# EAGLE design ciabatta (EAGLE 4.16)
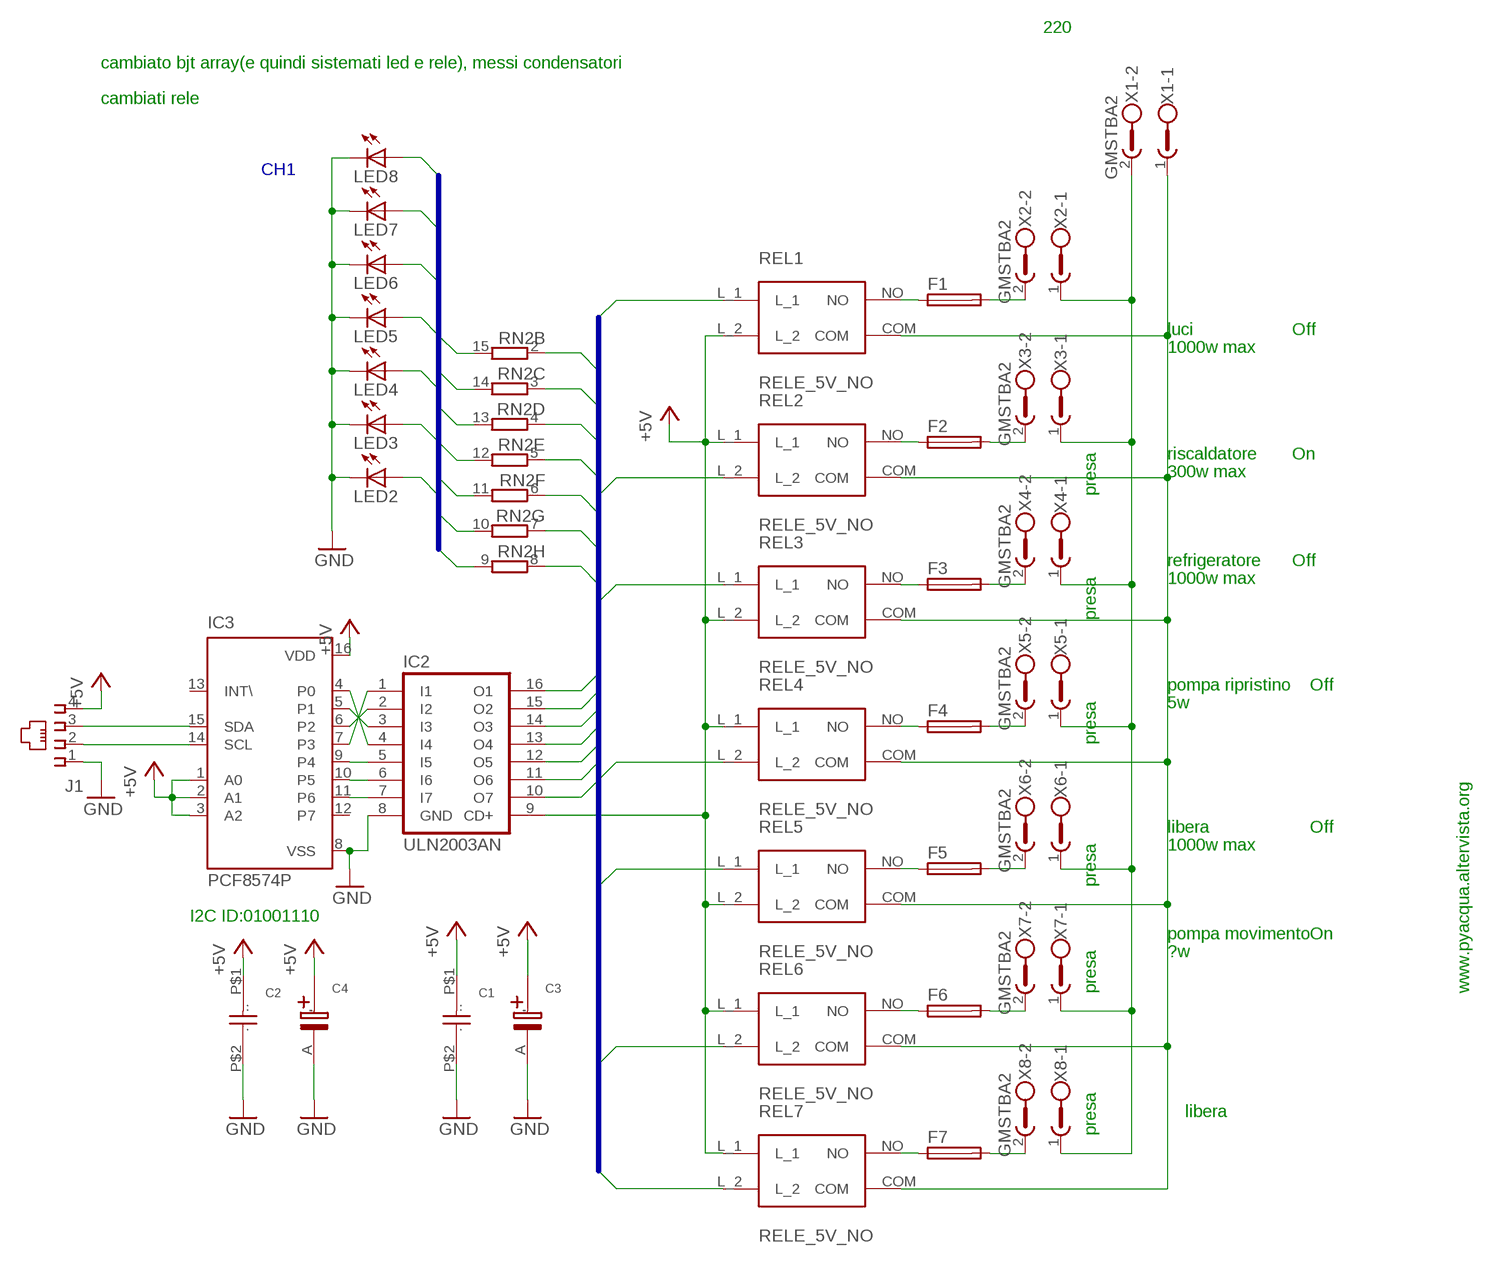
[diagram p0: schematic, sheet 1]

## Parts
C1  CAP_POLI  [CAP_POLI]
C2  CAP_POLI  [CAP_POLI]
C3  CAP_ELET  [CAP_ELET]
C4  CAP_ELET  [CAP_ELET]
F1  SH22,5A  [SH22,5A]
F2  SH22,5A  [SH22,5A]
F3  SH22,5A  [SH22,5A]
F4  SH22,5A  [SH22,5A]
F5  SH22,5A  [SH22,5A]
F6  SH22,5A  [SH22,5A]
F7  SH22,5A  [SH22,5A]
IC2  ULN2003AN  [DIL16]
IC3  PCF8574P  [DIL16]
J1  520242-2  [520242-2]
LED2  LED3MM  [LED3MM]
LED3  LED3MM  [LED3MM]
LED4  LED3MM  [LED3MM]
LED5  LED3MM  [LED3MM]
LED6  LED3MM  [LED3MM]
LED7  LED3MM  [LED3MM]
LED8  LED3MM  [LED3MM]
REL1  RELE_5V_NO  [RELE_5V_NO]
REL2  RELE_5V_NO  [RELE_5V_NO]
REL3  RELE_5V_NO  [RELE_5V_NO]
REL4  RELE_5V_NO  [RELE_5V_NO]
REL5  RELE_5V_NO  [RELE_5V_NO]
REL6  RELE_5V_NO  [RELE_5V_NO]
REL7  RELE_5V_NO  [RELE_5V_NO]
RN2  8R-N  [DIL16]
X1  GMSTBA2  [GMSTBA2]
X2  GMSTBA2  [GMSTBA2]
X3  GMSTBA2  [GMSTBA2]
X4  GMSTBA2  [GMSTBA2]
X5  GMSTBA2  [GMSTBA2]
X6  GMSTBA2  [GMSTBA2]
X7  GMSTBA2  [GMSTBA2]
X8  GMSTBA2  [GMSTBA2]

## Nets
+5V [vcc]: C1.P$1(.) C2.P$1(.) C3.B(.) C4.B(.) IC2.9(CD+) IC3.1(A0) IC3.2(A1) IC3.3(A2) IC3.16(VDD) J1.4 REL1.L_2 REL2.L_1 REL3.L_2 REL4.L_1 REL5.L_2 REL6.L_1 REL7.L_1
CH1: IC2.16(O1) REL1.L_1 RN2.2
CH2: IC2.15(O2) REL2.L_2 RN2.3
CH3: IC2.14(O3) REL3.L_1 RN2.4
CH4: IC2.13(O4) REL4.L_2 RN2.5
CH5: IC2.12(O5) REL5.L_1 RN2.6
CH6: IC2.11(O6) REL6.L_2 RN2.7
CH7: IC2.10(O7) REL7.L_2 RN2.8
GND [vcc]: C1.P$2(..) C2.P$2(..) C3.A(') C4.A(') IC2.8(GND) IC3.8(VSS) J1.1 LED2.K(C) LED3.K(C) LED4.K(C) LED5.K(C) LED6.K(C) LED7.K(C) LED8.K(C)
LED1: LED2.A RN2.9
LED2: LED3.A RN2.10
LED3: LED4.A RN2.11
LED4: LED5.A RN2.12
LED5: LED6.A RN2.13
LED6: LED7.A RN2.14
LED7: LED8.A RN2.15
N$1 [220]: F3.1 REL3.NO
N$2 [signal2]: IC2.1(I1) IC3.7(P3)
N$3 [signal2]: IC2.7(I7) IC3.11(P6)
N$4 [signal2]: IC2.6(I6) IC3.10(P5)
N$5 [signal2]: IC2.5(I5) IC3.9(P4)
N$6 [signal2]: IC2.2(I2) IC3.6(P2)
N$7 [signal2]: IC2.3(I3) IC3.5(P1)
N$8 [signal2]: IC2.4(I4) IC3.4(P0)
N$9 [220]: F2.1 REL2.NO
N$10 [signal2]: IC3.14(SCL) J1.2
N$11 [220]: F1.1 REL1.NO
N$12 [signal2]: IC3.15(SDA) J1.3
N$13 [220]: F4.1 REL4.NO
N$15 [220]: F5.1 REL5.NO
N$16 [220]: F5.2 X6.2
N$17 [220]: F4.2 X5.2
N$18 [220]: F3.2 X4.2
N$19 [220]: F7.1 REL7.NO
N$20 [220]: F6.1 REL6.NO
N$21 [220]: F6.2 X7.2
N$22 [220]: F7.2 X8.2
N$23 [220]: X1.2 X2.1 X3.1 X4.1 X5.1 X6.1 X7.1 X8.1
N$24 [220]: REL1.COM REL2.COM REL3.COM REL4.COM REL5.COM REL6.COM REL7.COM X1.1
N$25 [220]: F1.2 X2.2
N$26 [220]: F2.2 X3.2
Unconnected: IC3.12(P7) IC3.13(INT\) RN2.1 RN2.16

## Buses
BUS:CH[1..7]
LED:LED[1..7]

## Notes on the sheet
- 220
- cambiato bjt array(e quindi sistemati led e rele), messi condensatori
- cambiati rele
- CH1
- luci | Off
- 1000w max
- riscaldatore | On
- 300w max
- presa
- refrigeratore | Off
- 1000w max
- presa
- pompa ripristino | Off
- 5w
- presa
- libera | Off
- 1000w max
- presa
- I2C ID:01001110
- pompa movimento | On
- ?w
- presa | www.pyacqua.altervista.org
- libera
- presa

## Library data of the parts
C1 C2 = aggiunte:CAP_POLI: Condensatore non elett passo 5.08 mm (2 x 2.54)
C3 C4 = aggiunte:CAP_ELET: Condensatore elett. passo 2.54 mm
F1-F7 = fuse:SH22,5A: FUSE HOLDER grid 22,5mm, isolated cap OGN0031 8201, Schurter (Buerklin)
IC2 = uln-udn:ULN2003A: DRIVER ARRAY
IC3 = micro-philips:PCF8574: I2C-Bus Remote 8-bit I/O expander http://www.semiconductors.philips.com/acrobat_download/datasheets/PCF8574_4.pdf
J1 = con-amp:520242-2: AMP connector
LED2-LED8 = led:LED: LED OSRAM: - CHIPLED LG R971, LG N971, LY N971, LG Q971, LY Q971, LO R971, LY R971 LH N974, LH R974 LS Q976, LO Q976, LY Q976 LO Q996 - Hyper CHIPLED LW Q18S LB Q993, LB Q99A, LB R99A - SideLED LS A670, LO A670, LY A670, LG A670, LP A670 LB A673, LV A673, LT A673, LW A673 LH A674 LY A675 LS A676, LA A676, LO A676, LY A676, LW A676 LS A679, LY A679, LG A679 - Hyper Micro SIDELED® LS Y876, LA Y876, LO Y876, LY Y876 LT Y87S - SmartLED LW L88C, LW L88S LB L89C, LB L89S, LG L890 LS L89K, LO L89K, LY L89K LS L896, LA L896, LO L896, LY L896 - TOPLED LS T670, LO T670, LY T670, LG T670, LP T670 LSG T670, LSP T670, LSY T670, LOP T670, LYG T670 LG T671, LOG T671, LSG T671 LB T673, LV T673, LT T673, LW T673 LH T674 LS T676, LA T676, LO T676, LY T676, LB T676, LH T676, LSB T676, LW T676 LB T67C, LV T67C, LT T67C, LS T67K, LO T67K, LY T67K, LW E67C LS E67B, LA E67B, LO E67B, LY E67B, LB E67C, LV E67C, LT E67C LW T67C LS T679, LY T679, LG T679 LS T770, LO T770, LY T770, LG T770, LP T770 LB T773, LV T773, LT T773, LW T773 LH T774 LS E675, LA E675, LY E675, LS T675 LS T776, LA T776, LO T776, LY T776, LB T776 LHGB T686 LT T68C, LB T68C - Hyper Mini TOPLED® LB M676 - Mini TOPLED Santana® LG M470 LS M47K, LO M47K, LY M47K Source: http://www.osram.convergy.de - LUMILED® LXK2-PW12-R00, LXK2-PW12-S00, LXK2-PW14-U00, LXK2-PW14-V00 LXK2-PM12-R00, LXK2-PM12-S00, LXK2-PM14-U00 LXK2-PE12-Q00, LXK2-PE12-R00, LXK2-PE12-S00, LXK2-PE14-T00, LXK2-PE14-U00 LXK2-PB12-K00, LXK2-PB12-L00, LXK2-PB12-M00, LXK2-PB14-N00, LXK2-PB14-P00, LXK2-PB14-Q00 LXK2-PR12-L00, LXK2-PR12-M00, LXK2-PR14-Q00, LXK2-PR14-R00 LXK2-PD12-Q00, LXK2-PD12-R00, LXK2-PD12-S00 LXK2-PH12-R00, LXK2-PH12-S00 LXK2-PL12-P00, LXK2-PL12-Q00, LXK2-PL12-R00 Source: www.luxeon.com
REL1-REL7 = aggiunte:RELE_5V_NO: Rele 5V NO 10A Codice RS 511-2142 Costruttore Tyco Electronics Schrack Codice Costruttore PB114005
RN2 = resistor-dil:8R-N: DIL RESISTOR
X1-X8 = con-phoenix-508:GMSTBA2: PHOENIX

## Net classes
0 signal: width 0.508 mm
1 220: width 3.81 mm
2 signal2: width 0.508 mm
3 vcc: width 1.016 mm
4 smd: width 0.203 mm

## Board
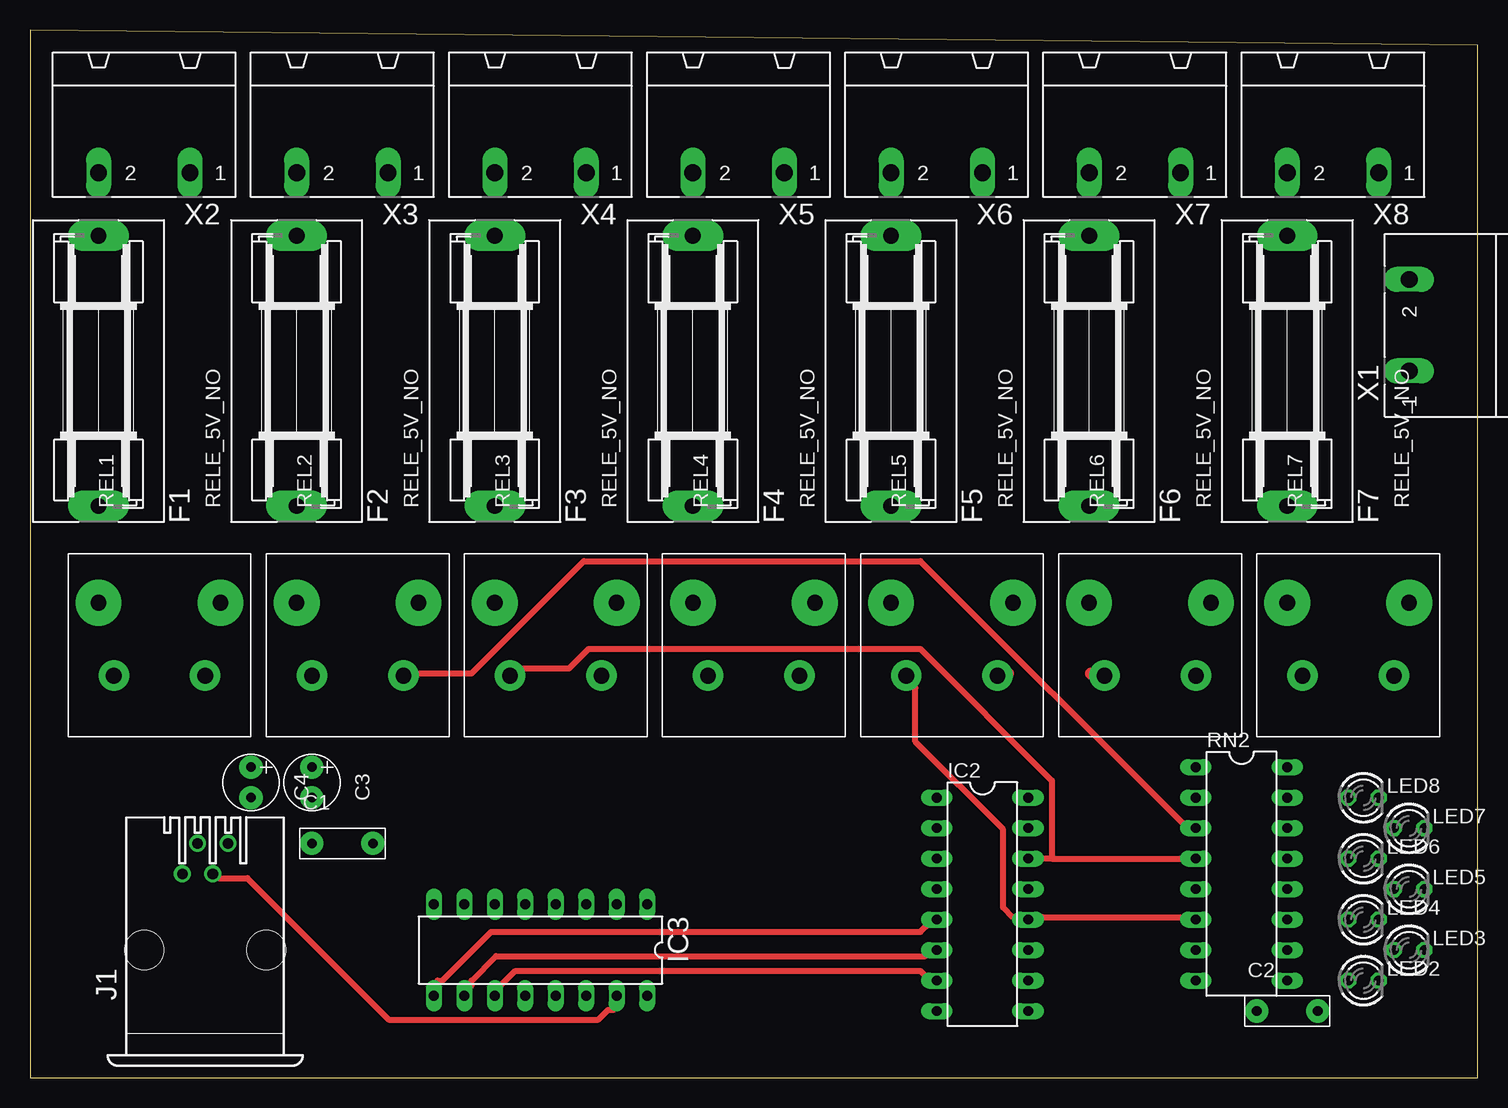
[diagram p1: board, top side]
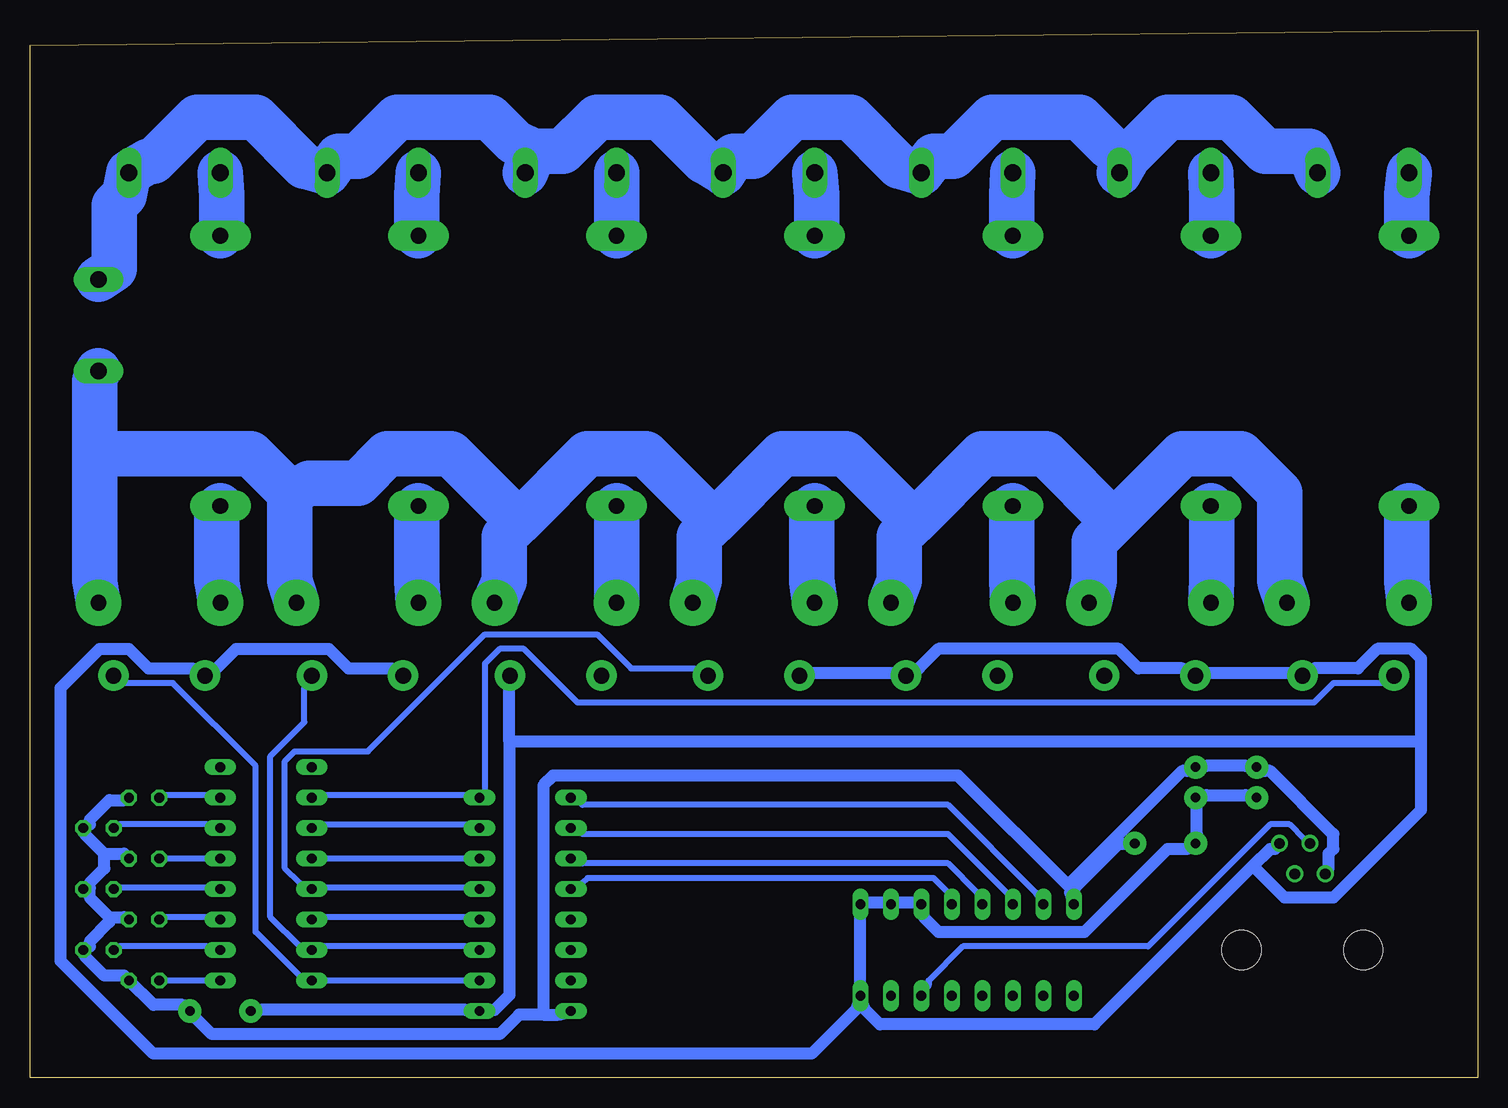
[diagram p2: board, bottom side, seen from below]

Size 120.63 x 87.3 mm. Coordinates in mm from the lower left corner, seen from the top.
Outline: 0,0 120.63,0 120.63,86.03 0,87.3 0,0
Copper layers (1*16): Top 0.035mm / dielectric 1.5mm / Bottom 0.035mm
Design rules "mio": minimum track width 10mil, minimum drill 24mil, track to track 16mil, track to pad 16mil, pad to pad 16mil, via to via 16mil, smd to smd 8mil, copper to edge 40mil, drill to drill 8mil, minimum pad ring 10mil, minimum via ring 8mil, stop-mask expansion 4mil, vias tented up to drill 0mil, thermal gap 10mil

### Footprints (pad centres in the part's own frame; a part is rotated, then mirrored left to right if it is on the bottom)
CAP_POLI = drill 0.8 pad 1.93 round: P$1 -5.08,0; P$2 0,0
CAP_ELET = drill 0.8 pad 1.93 round: A -2.54,0; B 0,0
SH22,5A = drill 1.321 pad 2.54 long: 1 -11.252,0; 2 11.252,0
DIL16 = drill 0.813 long: 1 -8.89,-3.81; 2 -6.35,-3.81; 3 -3.81,-3.81; 4 -1.27,-3.81; 5 1.27,-3.81; 6 3.81,-3.81; 7 6.35,-3.81; 8 8.89,-3.81; 9 8.89,3.81; 10 6.35,3.81; 11 3.81,3.81; 12 1.27,3.81; 13 -1.27,3.81; 14 -3.81,3.81; 15 -6.35,3.81; 16 -8.89,3.81
520242-2 = drill 0.889 round: 1 -1.905,6.35; 2 -0.635,8.89; 3 0.635,6.35; 4 1.905,8.89 | hole 3.251: -5.08,0; 5.08,0
LED3MM = drill 0.813 octagon: A -1.27,0; K 1.27,0
RELE_5V_NO = drill 1.3 pad 3.81 round: COM 6.08,-1.27; NO 6.08,8.89 | drill 1.3 pad 2.54 round: L_1 0,7.62; L_2 0,0
GMSTBA2 = drill 1.397 long: 1 -3.81,5.08; 2 3.81,5.08

### Placement (x,y rotation side)
C1  28.57,19.52 0 top
C2  107.31,5.55 0 top
C3  23.49,23.33 270 top
C4  18.41,23.33 270 top
F1  5.71,58.89 90 top
F2  22.22,58.89 90 top
F3  38.73,58.89 90 top
F4  55.24,58.89 90 top
F5  71.75,58.89 90 top
F6  88.26,58.89 90 top
F7  104.77,58.89 90 top
IC2  79.37,14.44 270 top
IC3  42.54,10.63 180 top
J1  14.6,10.63 0 top
LED2  111.12,8.09 0 top
LED3  114.93,10.63 0 top
LED4  111.12,13.17 0 top
LED5  114.93,15.71 0 top
LED6  111.12,18.25 0 top
LED7  114.93,20.79 0 top
LED8  111.12,23.33 0 top
REL1  14.6,33.49 90 top
REL2  31.11,33.49 90 top
REL3  47.62,33.49 90 top
REL4  64.13,33.49 90 top
REL5  80.64,33.49 90 top
REL6  97.15,33.49 90 top
REL7  113.66,33.49 90 top
RN2  100.96,16.98 270 top
X1  120.01,62.7 90 top
X2  9.52,80.48 180 top
X3  26.03,80.48 180 top
X4  42.54,80.48 180 top
X5  59.05,80.48 180 top
X6  75.56,80.48 180 top
X7  92.07,80.48 180 top
X8  108.58,80.48 180 top

### Tracks (layer width: path | path; a pad name or v marks a point on that pad's centre or on a via)
+5V
  Top 1.016: REL5.L_2 81.5,33.69 | REL6.L_1 88.41,33.69
  Bottom 1.016: REL6.L_1 90.44,34.1 94.1,34.1 95.73,35.72 103.45,35.72 105.07,34.1 REL7.L_1 107.11,34.1 110.76,34.1 112.39,35.72 114.83,35.72 118.08,32.47 118.08,9.72 110.36,1.99 55.49,1.99 51.84,5.65 IC3.16 | REL4.L_1 55.49,33.69 48.59,33.69 REL3.L_2 46.55,34.1 44.93,35.72 29.89,35.72 28.27,34.1 24.61,34.1 REL2.L_1 22.58,33.69 15.67,33.69 REL1.L_2 13.64,34.1 9.98,34.1 8.35,35.72 5.51,35.72 4.69,34.91 4.69,28 | C2.P$1 101.42,5.65 84.35,5.65 IC2.9 81.91,5.65 80.69,6.87 80.69,28 | IC3.16 IC3.1 51.02,14.59 49.4,14.59 IC3.2 48.59,14.59 46.96,14.59 IC3.3 46.15,13.37 44.93,12.15 32.74,12.15 25.83,19.06 24.2,19.06 C1.P$1 23.39,20.28 23.39,22.72 C3.B 22.58,23.53 19.32,23.53 C4.B | 80.69,28 80.69,32.47 REL5.L_2 | 18.71,17.64 31.92,4.43 49.8,4.43 51.02,5.65 IC3.16 | 18.71,17.64 17.29,19.06 16.89,19.06 J1.4 | 4.69,28 4.69,22.31 12.01,15 16.07,15 18.71,17.64 | 4.69,28 80.69,28
CH1
  Bottom 0.508: RN2.2 96.13,23.53 84.35,23.53 IC2.16 82.72,23.94 82.72,34.51 81.5,35.72 79.47,35.72 75,31.25 13.64,31.25 12.01,32.88 7.95,32.88 REL1.L_1
CH2
  Top 0.508: REL2.L_2 32.33,33.69 36.8,33.69 46.15,43.04 74.19,43.04 96.13,21.1 RN2.3
  Bottom 0.508: IC2.15 84.35,21.1 96.13,21.1 RN2.3
CH3
  Top 0.508: 85.16,18.25 IC2.14 | 85.16,18.25 RN2.4 | 85.16,18.25 85.16,24.75 74.19,35.72 46.55,35.72 44.93,34.1 40.86,34.1 REL3.L_1
  Bottom 0.508: IC2.14 RN2.4
CH4
  Bottom 0.508: IC2.13 84.35,15.81 96.13,15.81 RN2.5 98.17,16.22 99.38,17.44 99.38,26.38 98.57,27.19 92.48,27.19 82.72,36.94 73.38,36.94 70.53,34.1 65.25,34.1 REL4.L_2
CH5
  Top 0.508: RN2.6 96.13,13.37 84.35,13.37 IC2.12 81.91,13.37 81.1,14.19 81.1,20.69 73.78,28 73.78,32.47 REL5.L_1
  Bottom 0.508: IC2.12 84.35,13.37 96.13,13.37 RN2.6
CH6
  Bottom 0.508: REL6.L_2 97.76,32.47 97.76,29.63 100.6,26.78 100.6,13.37 98.17,10.93 RN2.7 96.13,10.93 84.35,10.93 IC2.11
CH7
  Bottom 0.508: REL7.L_2 112.8,32.88 108.73,32.88 101.82,25.97 101.82,12.15 98.17,8.5 RN2.8 IC2.10
GND
  Bottom 1.016: 114.02,13.37 112.8,13.37 LED4.K | 114.02,13.37 115.64,15 115.64,15.81 | 114.02,13.37 114.02,12.97 115.64,11.34 115.64,10.93 LED3.K 116.05,10.12 114.42,8.5 112.8,8.5 LED2.K 110.36,6.06 107.92,6.06 C2.P$2 106.7,4.84 105.48,3.62 81.5,3.62 79.88,5.25 77.85,5.25 | 114.42,18.66 112.8,18.66 LED6.K | 114.42,18.66 116.05,20.28 LED7.K 115.64,21.1 115.64,21.5 114.02,23.13 112.8,23.13 LED8.K | 115.64,15.81 LED5.K | 114.42,18.66 114.42,17.44 115.64,16.22 115.64,15.81 | 77.85,5.25 76.63,5.25 IC2.8 | 33.96,15.81 43.3,25.16 77.03,25.16 77.85,24.35 77.85,5.25 | 33.96,15.81 33.96,15.41 IC3.8 | C1.P$2 29.48,19.47 29.89,19.47 33.55,15.81 33.96,15.81 | J1.1 12.42,17.44 12.42,18.66 12.01,19.06 12.01,20.28 17.29,25.57 17.7,25.57 C4.A 19.32,25.97 22.58,25.97 C3.A 24.2,25.57 24.61,25.57 33.96,16.22 33.96,15.81
LED1
  Bottom 0.508: RN2.9 LED2.A
LED2
  Bottom 0.508: RN2.10 105.89,10.93 113.2,10.93 LED3.A
LED3
  Bottom 0.508: RN2.11 105.89,13.37 109.55,13.37 LED4.A
LED4
  Bottom 0.508: RN2.12 105.89,15.81 113.2,15.81 LED5.A
LED5
  Bottom 0.508: RN2.13 LED6.A
LED6
  Bottom 0.508: RN2.14 105.89,21.1 113.2,21.1 LED7.A
LED7
  Bottom 0.508: RN2.15 105.89,23.53 109.55,23.53 LED8.A
N$1
  Bottom 3.81: F3.1 38.83,46.7 38.83,41.42 REL3.NO
N$2
  Bottom 0.508: IC3.7 36.8,15.41 44.12,22.72 74.59,22.72 IC2.1
N$3
  Top 0.508: IC3.11 39.24,7.68 40.46,8.9 74.19,8.9 74.59,8.5 IC2.7
N$4
  Top 0.508: IC3.10 36.8,7.68 36.8,8.09 38.83,10.12 74.59,10.12 IC2.6
N$5
  Top 0.508: IC3.9 33.96,8.09 34.36,8.09 38.43,12.15 74.19,12.15 74.59,12.56 IC2.5
N$6
  Bottom 0.508: IC3.6 39.24,15.41 44.12,20.28 74.59,20.28 IC2.2
N$7
  Bottom 0.508: IC3.5 41.68,15.41 44.12,17.84 74.59,17.84 IC2.3
N$8
  Bottom 0.508: IC3.4 44.12,15.41 45.33,16.62 74.19,16.62 74.59,16.22 IC2.4
N$9
  Bottom 3.81: F2.1 22.17,46.7 22.17,41.42 REL2.NO
N$10
  Bottom 0.508: IC3.14 45.74,7.68 45.74,8.09 42.9,10.93 27.45,10.93 17.29,21.1 15.67,21.1 14.45,19.88 J1.2
N$11
  Bottom 3.81: F1.1 5.91,46.7 5.91,41.42 REL1.NO
N$12
  Top 0.508: IC3.15 48.59,5.65 48.18,5.65 47.37,4.84 29.89,4.84 18.11,16.62 15.67,16.62 J1.3
N$13
  Bottom 3.81: F4.1 55.49,46.7 55.49,41.42 REL4.NO
N$15
  Bottom 3.81: REL5.NO F5.1
N$16
  Bottom 3.81: F5.2 X6.2
N$17
  Bottom 3.81: X5.2 55.09,73.52 55.09,71.08 F4.2
N$18
  Bottom 3.81: X4.2 38.83,73.52 38.83,71.08 F3.2
N$19
  Bottom 3.81: F7.1 105.07,46.7 105.07,41.42 REL7.NO
N$20
  Bottom 3.81: F6.1 88.41,46.7 88.41,41.42 REL6.NO
N$21
  Bottom 3.81: X7.2 88.41,73.52 88.41,71.08 F6.2
N$22
  Bottom 3.81: X8.2 104.67,73.52 104.67,71.08 F7.2
N$23
  Bottom 3.81: X1.2 113.61,67.42 113.61,72.71 112.8,73.52 X8.1 110.76,76.36 110.36,76.36 106.7,80.02 101.82,80.02 97.76,75.96 X7.1 94.91,76.77 93.29,76.77 90.04,80.02 82.32,80.02 80.28,77.99 78.66,77.18 | 29.08,76.77 25.83,80.02 20.54,80.02 17.7,77.18 14.04,77.18 X2.1 | 29.08,76.77 X3.1 | 29.08,76.77 30.7,77.58 33.14,80.02 40.46,80.02 43.71,76.77 45.33,76.77 X4.1 48.18,75.96 52.24,80.02 57.12,80.02 60.37,76.77 62,76.77 X5.1 64.44,76.36 68.09,80.02 73.38,80.02 76.22,77.18 78.66,77.18 | 78.66,77.18 X6.1
N$24
  Bottom 3.81: 115.23,51.98 115.23,41.42 REL7.COM | 115.23,51.98 115.23,58.08 X1.1 | 98.98,48.73 98.98,41.42 REL6.COM | 98.98,48.73 102.23,51.98 115.23,51.98 | 30.3,46.29 31.92,44.67 31.92,41.42 REL2.COM | 30.3,46.29 24.61,51.98 19.73,51.98 16.48,48.73 16.48,41.42 REL1.COM | 46.96,46.29 41.27,51.98 35.99,51.98 30.3,46.29 | 46.96,46.29 48.18,45.07 48.18,41.42 REL3.COM | 63.62,46.29 57.93,51.98 52.65,51.98 46.96,46.29 | 63.62,46.29 64.84,45.07 64.84,41.42 REL4.COM | 79.88,46.29 74.19,51.98 69.31,51.98 63.62,46.29 | 79.88,46.29 81.1,45.07 81.1,41.42 REL5.COM | 98.98,48.73 97.35,49.54 93.29,49.54 90.85,51.98 85.57,51.98 79.88,46.29
N$25
  Bottom 3.81: X2.2 5.91,73.52 5.91,71.08 F1.2
N$26
  Bottom 3.81: X3.2 22.17,73.52 22.17,71.08 F2.2